# Altium schematic sheet SCH.SchDoc
size A3; SheetNumber: 1; SheetTotal: 1
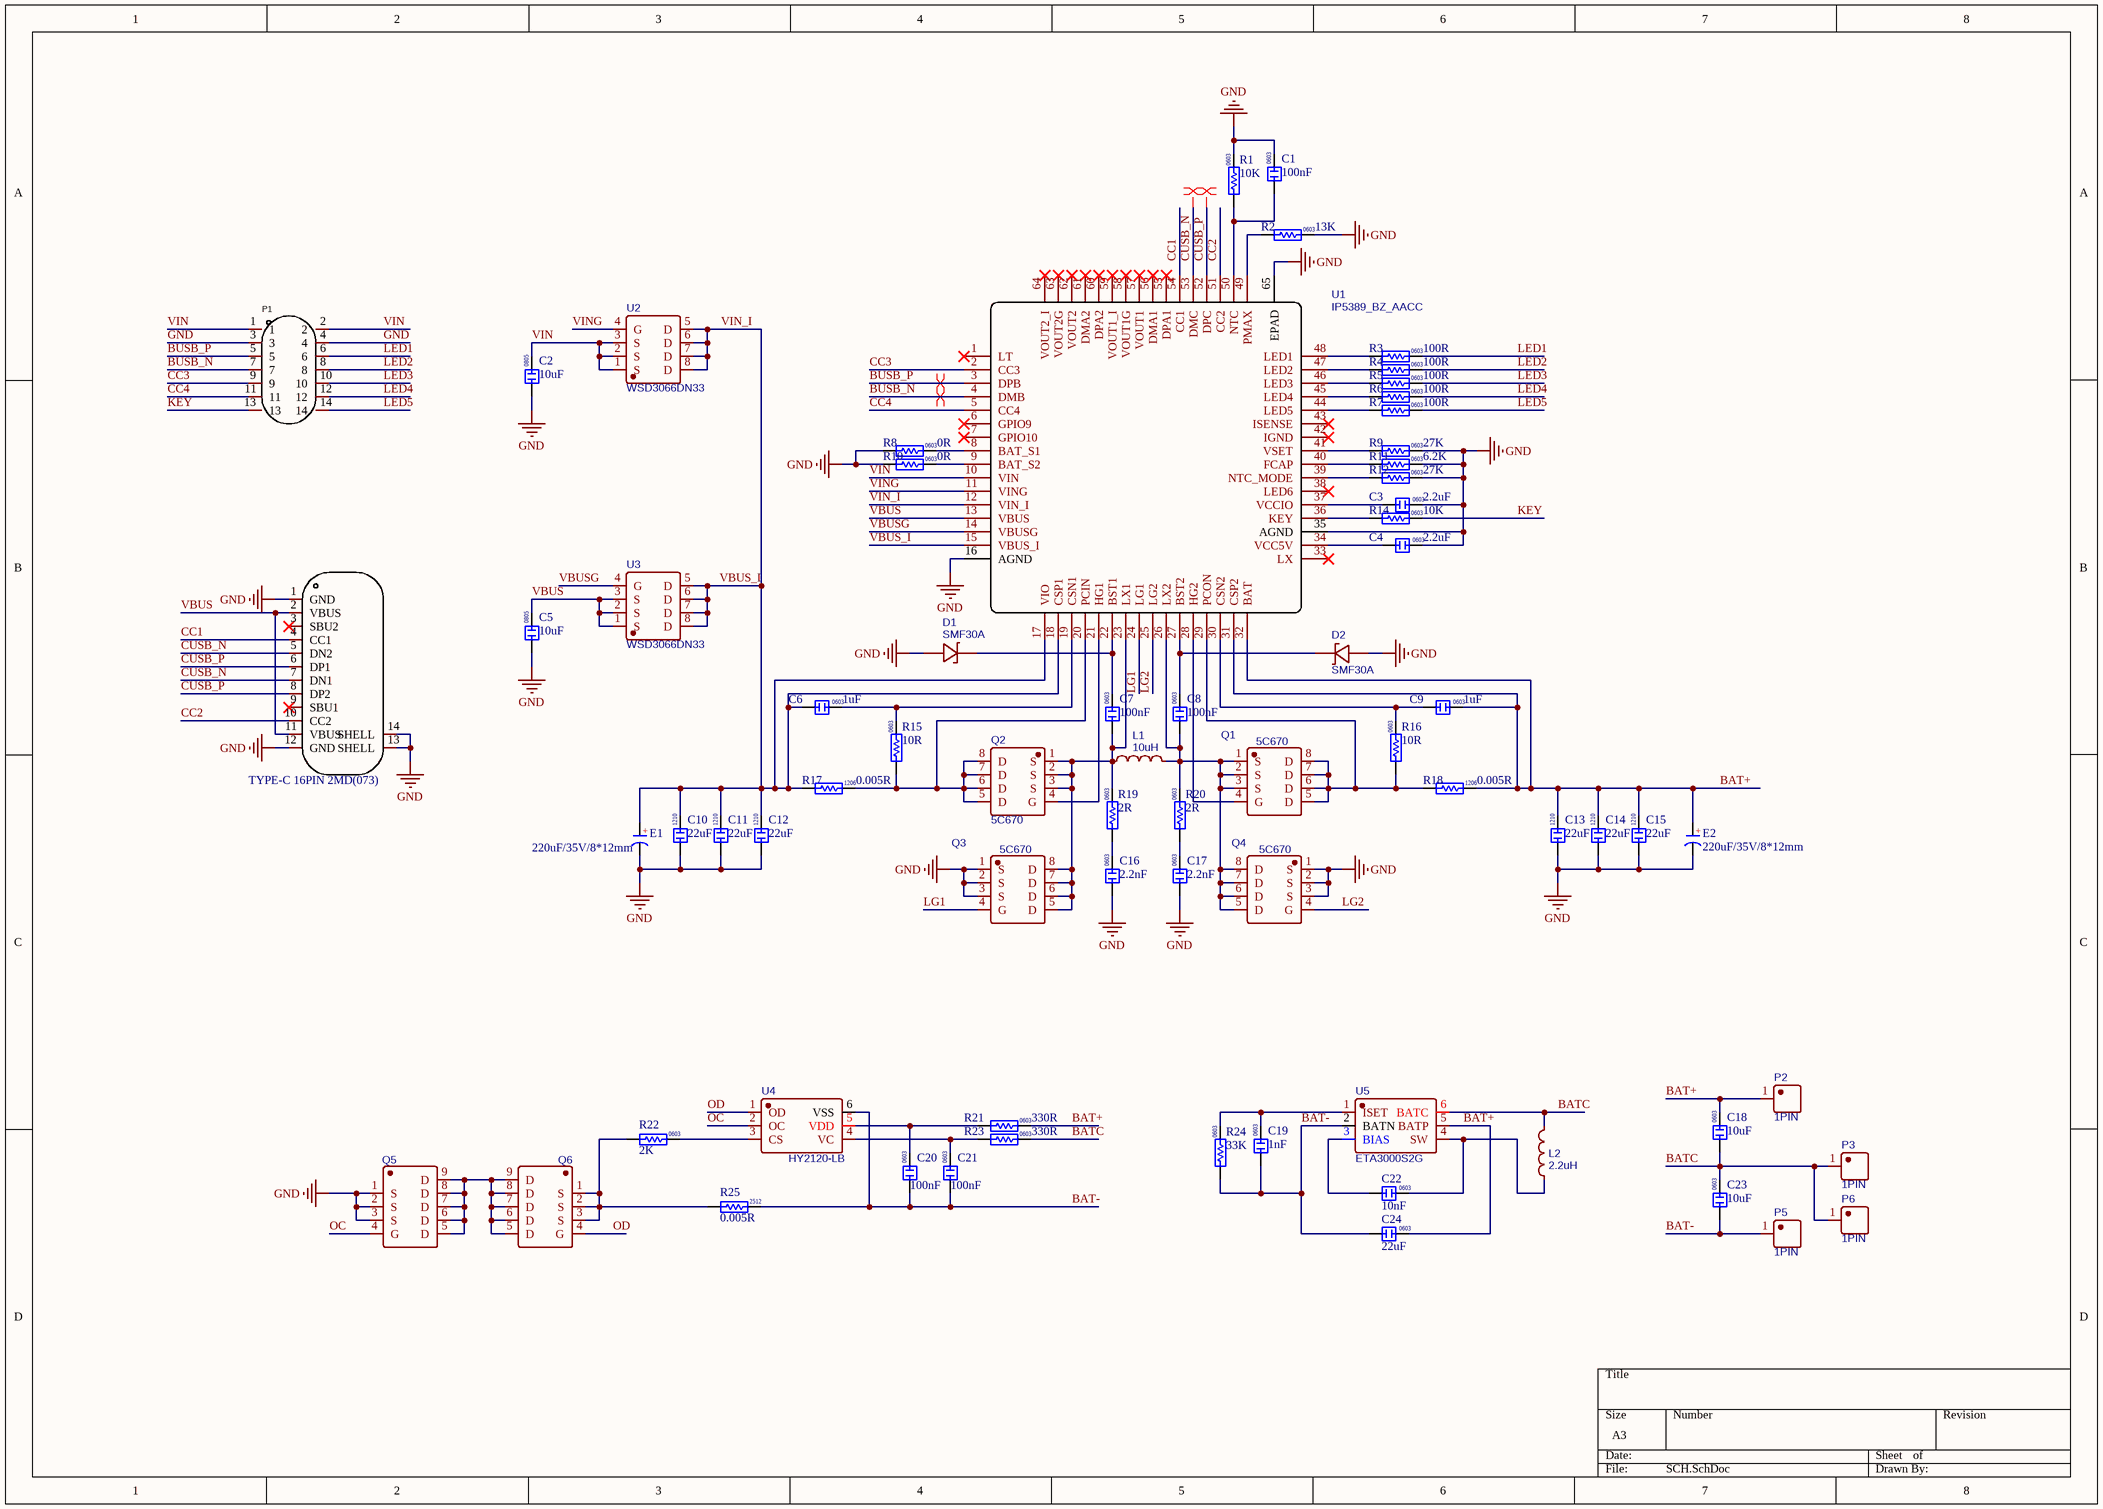
[diagram p0: SCH.SchDoc]

## Parts
C1  100nF  [C_0603]
C2  10uF  [C_0805]
C3  2.2uF  [C_0603]
C4  2.2uF  [C_0603]
C5  10uF  [C_0805]
C6  1uF  [C_0603]
C7  100nF  [C_0603]
C8  100nF  [C_0603]
C9  1uF  [C_0603]
C10  22uF  [C_1210]
C11  22uF  [C_1210]
C12  22uF  [C_1210]
C13  22uF  [C_1210]
C14  22uF  [C_1210]
C15  22uF  [C_1210]
C16  2.2nF  [C_0603]
C17  2.2nF  [C_0603]
C18  10uF  [C_0603]
C19  1nF  [C_0603]
C20  100nF  [C_0603]
C21  100nF  [C_0603]
C22  10nF  [C_0603]
C23  10uF  [C_0603]
C24  22uF  [C_0603]
D1  SMF30A  [SOD-123FL_L2.6-W1.6-LS3.4-R-FD]
D2  SMF30A  [SOD-123FL_L2.6-W1.6-LS3.4-R-FD]
E1  220uF/35V/8*12mm  [CAP 3.5*8*12_L]
E2  220uF/35V/8*12mm  [CAP 3.5*8*12_L]
L1  10uH  [IND-SMD_L11.0-W10.2]
L2  2.2uH  [L_4*4]
P1  X1321WR-2x07J-C40D18  [HDR-TH_14P-P1.27-H-M-R2-C7-S1.27-W7.5-N2]  (value not drawn)
P2  1PIN  [1PIN]
P3  1PIN  [1PIN]
P5  1PIN  [1PIN]
P6  1PIN  [1PIN]
Q1  5C670  [DFN-5_L6.1-W5.1-P1.27-BL]
Q2  5C670  [DFN-5_L6.1-W5.1-P1.27-BL]
Q3  5C670  [DFN-5_L6.1-W5.1-P1.27-BL]
Q4  5C670  [DFN-5_L6.1-W5.1-P1.27-BL]
Q5  TPH1R403NL  [DSOP-8_L5.0-W5.0-P1.27-LS6.0-BL-EP]  (value not drawn)
Q6  TPH1R403NL  [DSOP-8_L5.0-W5.0-P1.27-LS6.0-BL-EP]  (value not drawn)
R1  10K  [R_0603]
R2  13K  [R_0603]
R3  100R  [R_0603]
R4  100R  [R_0603]
R5  100R  [R_0603]
R6  100R  [R_0603]
R7  100R  [R_0603]
R8  0R  [R_0603]
R9  27K  [R_0603]
R10  0R  [R_0603]
R11  6.2K  [R_0603]
R12  27K  [R_0603]
R14  10K  [R_0603]
R15  10R  [R_0603]
R16  10R  [R_0603]
R17  0.005R  [R_1206]
R18  0.005R  [R_1206]
R19  2R  [R_0603]
R20  2R  [R_0603]
R21  330R  [R_0603]
R22  2K  [R_0603]
R23  330R  [R_0603]
R24  33K  [R_0603]
R25  0.005R  [R_2512]
U1  IP5389_BZ_AACC  [QFN-64_IP5389]
U2  WSD3066DN33  [DFN-8_L3.3-W3.3-P0.65-BL]
U3  WSD3066DN33  [DFN-8_L3.3-W3.3-P0.65-BL]
U4  HY2120-LB  [SOT-23-6_L2.9-W1.6-P0.95-LS2.8-BR]
U5  ETA3000S2G  [SOT-23-6_L2.9-W1.6-P0.95-LS2.8-BL]
USB1  TYPE-C 16PIN 2MD(073)  [USB-C-SMD_TYPE-C-6PIN-2MD-073]

## Nets
GND: C1.2 C2.1 C3.2 C4.2 C5.1 C10.1 C11.1 C12.1 C13.1 C14.1 C15.1 C16.1 C17.1 D1.2(A) D2.2(A) E1.2(K) E2.2(K) P1.3 P1.4 Q3.1(S) Q3.2(S) Q3.3(S) Q4.1(S) Q4.2(S) Q4.3(S) Q5.1(S) Q5.2(S) Q5.3(S) R1.2 R2.2 R8.1 R9.2 R10.1 R11.2 R12.2 U1.16(AGND) U1.35(AGND) U1.65(EPAD) USB1.1(GND) USB1.12(GND) USB1.13(SHELL) USB1.14(SHELL)
BAT+: C9.2 C13.2 C14.2 C15.2 C18.2 C24.2 E2.1(A) P2.1 R18.2 R21.2 U1.31(CSP2) U1.32(BAT) U5.5(BATP)
BAT-: C19.1 C20.1 C21.1 C23.1 C24.1 P5.1 R24.1 R25.2 U4.6(VSS) U5.2(BATN)
BATC: C18.1 C23.2 L2.2 P3.1 P6.1 R23.2 U5.6(BATC)
BUSB_N: P1.7 U1.4(DMB)
BUSB_P: P1.5 U1.3(DPB)
CC1: U1.54(CC1) USB1.4(CC1)
CC2: U1.51(CC2) USB1.10(CC2)
CC3: P1.9 U1.2(CC3)
CC4: P1.11 U1.5(CC4)
CUSB_N: U1.53(DMC) USB1.5(DN2) USB1.7(DN1)
CUSB_P: U1.52(DPC) USB1.6(DP1) USB1.8(DP2)
KEY: P1.13 R14.2
LED1: P1.6 R3.2
LED2: P1.8 R4.2
LED3: P1.10 R5.2
LED4: P1.12 R6.2
LED5: P1.14 R7.2
LG1: Q3.4(G) U1.24(LG1)
LG2: Q4.4(G) U1.25(LG2)
OC: Q5.4(G) U4.2(OC)
OD: Q6.4(G) U4.1(OD)
VBUS: C5.2 U1.13(VBUS) U3.1(S) U3.2(S) U3.3(S) USB1.2(VBUS) USB1.11(VBUS)
VBUS_I: C6.1 C10.2 C11.2 C12.2 E1.1(A) R17.1 U1.12(VIN_I) U1.15(VBUS_I) U1.17(VIO) U1.18(CSP1) U2.5(D) U2.6(D) U2.7(D) U2.8(D) U3.5(D) U3.6(D) U3.7(D) U3.8(D)  [also labelled VIN_I]
VBUSG: U1.14(VBUSG) U3.4(G)
VIN: C2.2 P1.1 P1.2 U1.10(VIN) U2.1(S) U2.2(S) U2.3(S)
VING: U1.11(VING) U2.4(G)
NetC1_1: C1.1 R1.1 U1.50(NTC)
NetC3_1: C3.1 U1.37(VCCIO)
NetC4_1: C4.1 U1.34(VCC5V)
NetC6_2: C6.2 R15.2 U1.19(CSN1)
NetC7_1: C7.1 L1.1 Q2.1(S) Q2.2(S) Q2.3(S) Q3.5(D) Q3.6(D) Q3.7(D) Q3.8(D) R19.2 U1.23(LX1)
NetC7_2: C7.2 D1.1(K) U1.22(BST1)
NetC8_1: C8.1 L1.2 Q1.1(S) Q1.2(S) Q1.3(S) Q4.5(D) Q4.6(D) Q4.7(D) Q4.8(D) R20.2 U1.26(LX2)
NetC8_2: C8.2 D2.1(K) U1.27(BST2)
NetC9_1: C9.1 R16.2 U1.30(CSN2)
NetC16_2: C16.2 R19.1
NetC17_2: C17.2 R20.1
NetC19_2: C19.2 R24.2 U5.1(ISET)
NetC20_2: C20.2 R21.1 U4.5(VDD)
NetC21_2: C21.2 R23.1 U4.4(VC)
NetC22_1: C22.1 U5.3(BIAS)
NetC22_2: C22.2 L2.1 U5.4(SW)
NetQ1_4: Q1.4(G) U1.28(HG2)
NetQ1_5: Q1.5(D) Q1.6(D) Q1.7(D) Q1.8(D) R16.1 R18.1 U1.29(PCON)
NetQ2_4: Q2.4(G) U1.21(HG1)
NetQ2_5: Q2.5(D) Q2.6(D) Q2.7(D) Q2.8(D) R15.1 R17.2 U1.20(PCIN)
NetQ5_5: Q5.5(D) Q5.6(D) Q5.7(D) Q5.8(D) Q5.9(D) Q6.5(D) Q6.6(D) Q6.7(D) Q6.8(D) Q6.9(D)
NetQ6_1: Q6.1(S) Q6.2(S) Q6.3(S) R22.1 R25.1
NetR2_1: R2.1 U1.49(PMAX)
NetR3_1: R3.1 U1.48(LED1)
NetR4_1: R4.1 U1.47(LED2)
NetR5_1: R5.1 U1.46(LED3)
NetR6_1: R6.1 U1.45(LED4)
NetR7_1: R7.1 U1.44(LED5)
NetR8_2: R8.2 U1.8(BAT_S1)
NetR9_1: R9.1 U1.41(VSET)
NetR10_2: R10.2 U1.9(BAT_S2)
NetR11_1: R11.1 U1.40(FCAP)
NetR12_1: R12.1 U1.39(NTC_MODE)
NetR14_1: R14.1 U1.36(KEY)
NetR22_2: R22.2 U4.3(CS)

Not connected (* = marked no-connect by the designer): U1 1(LT)* 6(GPIO9)* 7(GPIO10)* 33(LX)* 38(LED6)* 42(IGND)* 43(ISENSE)* 55(DPA1)* 56(DMA1)* 57(VOUT1)* 58(VOUT1G)* 59(VOUT1_I)* 60(DPA2)* 61(DMA2)* 62(VOUT2)* 63(VOUT2G)* 64(VOUT2_I)*; USB1 3(SBU2)* 9(SBU1)*

## Layout directives
differential pair: BUSB_N, BUSB_P, CUSB_N, CUSB_P

## Notes on the sheet
- (in symbol C-CS) +
- (in symbol C_0603) 0603
- (in symbol C_0805) 0805
- (in symbol C_1210) 1210
- (in symbol R_0603) 0603
- (in symbol R_1206) 1206
- (in symbol R_2512) 2512

## Library data of the parts
C1 C3 C4 C6-C9 C16-C24 = C_0603: 贴片电容
C2 C5 = C_0805: 贴片电容
C10-C15 = C_1210: 贴片电容
D1 D2 = SMF30A_C364281: Manufacturer: (MDD) Jiangsu Yutai Elec; Contributor: LCSC; Supplier: LCSC; Supplier Part: C364281; Manufacturer Part: SMF30A; JLCPCB Part Class: Extended Part; spicePre: D; spiceSymbolName: SMF30A_C364281
E1 E2 = C-CS: 直插固态电容; 版权归属: 源创客; BOM名称: 直插固态电容; 学习资源: www.ooocke.com
L1 = 5.6uH: PSPMAA1040H-100M-ANP; Manufacturer: Sunlord; Manufacturer Part: MWSA1206S-5R6MT; nameAlias: Inductance; Contributor: LCSC; Supplier: LCSC; Supplier Part: C408522; JLCPCB Part Class: Extended Part; spicePre: L; spiceSymbolName: MWSA1206S-5R6MT
L2 = 2.2uH: Manufacturer: EMTEK; Manufacturer Part: PHC0420-2R2M-T; nameAlias: Inductance; Contributor: LCSC; Supplier: LCSC; Supplier Part: C251688; JLCPCB Part Class: Extended Part; spicePre: L; spiceSymbolName: PHC0420-2R2M-T
P1 = X1321WR-2x07J-C40D18: 插针; Manufacturer: XKB Connectivity(中国星坤); Add into BOM: yes; Pitch: 1.27mm; Pin Structure: 2x7P; Circluar Pins/Square Pins: 方针; Current Rating (Max): 1A; Voltage Rating (Max): 250V; Welding Temperature (Max): 260℃; Name: X1321WR-2x07J-C40D18; Symbol: X1321WR-2X07J-C40D18; Device: X1321WR-2x07J-C40D18; LCSC Part Name: 1.27mm 2x7P 弯插 方针; Supplier Part: C2881827; Manufacturer Part: X1321WR-2x07J-C40D18; Supplier Footprint: 插件,P=1.27mm; JLCPCB Part Class: Extended Part; Supplier: LCSC; Convert to PCB: yes; Number of Pins: 14; Number of Rows: 2; Row Spacing: 1.27mm; Mounting Type: 弯插; Length of Mating Pin: 4mm; Insulation Height: 1mm; Length of End Connection Pin: -; Contact Material: 黄铜; Contact Plating: 金; Operating Temperature Range: -40℃~+105℃
P2 P3 P5 P6 = 1PIN: 焊点; Manufacturer: ZHENGLING; Manufacturer Part: Z-211-0311-0021-001; Contributor: LCSC; Supplier: LCSC; Supplier Part: C152153; JLCPCB Part Class: Extended Part; spicePre: H; spiceSymbolName: Z-211-0311-0021-001
Q1-Q4 = 5C670: NTMFS5C670NLT1G; Manufacturer: ON Semicon; Contributor: LCSC; Supplier: LCSC; Supplier Part: C179626; Manufacturer Part: NTMFS5C670NLT1G; JLCPCB Part Class: Extended Part; spicePre: Q; spiceSymbolName: BSC059N04LS6
Q5 Q6 = SIRA12DP-T1-GE3: Manufacturer: Vishay Intertech; Contributor: LCSC; Supplier: LCSC; Supplier Part: C241863; Manufacturer Part: SIRA12DP-T1-GE3; JLCPCB Part Class: Extended Part; spicePre: Q; spiceSymbolName: SIRA12DP-T1-GE3
R1-R12 R14-R16 R19-R24 = R_0603: 贴片电阻
R17 R18 = R_1206: 贴片电阻
R25 = R_2512: 贴片电阻
U1 = IP5389_BZ_AACC: 芯片; Contributor: LoveLoli; spicePre: U; spiceSymbolName: IP5389
U2 U3 = WSD3066DN33: NMOS管; Manufacturer Part: NTMFS5C670NLT1G; Manufacturer: ON Semicon; Contributor: LCSC; Supplier: LCSC; Supplier Part: C179626; JLCPCB Part Class: Extended Part; spicePre: Q; spiceSymbolName: BSC059N04LS6
U4 = HY2120-LB: Manufacturer: HYCON; Contributor: LCSC; Supplier: LCSC; Manufacturer Part: HY2120-LB; Supplier Part: C168778; JLCPCB Part Class: Extended Part; spicePre: U; spiceSymbolName: HY2120-LB
U5 = ETA3000S2G: 芯片; Manufacturer: ETA(钰泰); Contributor: ryq1212; SMT Type: Extend; Manufacturer Part: ETA3000S2G; LCSC Assembly: Yes; spicePre: U; spiceSymbolName: ETA3000S2G
USB1 = TYPE-C 16PIN 2MD(073): USB C母座; Manufacturer: SHOU HAN(首韩); Add into BOM: yes; Gender: 母座; Number of Contacts: 16; Number of Ports: 1; Current Rating - Power (Max): 5A; Name: TYPE-C 16PIN 2MD(073); Symbol: TYPE-C 16PIN 2MD(073); Device: TYPE-C 16PIN 2MD(073); LCSC Part Name: TYPE-C母座 16P 4脚插件带定位柱 不锈钢外壳 2次模顶; Supplier Part: C2765186; Manufacturer Part: TYPE-C 16PIN 2MD(073); Supplier Footprint: SMD; JLCPCB Part Class: Extended Part; Supplier: LCSC; Convert to PCB: yes; Connector Type: Type-C; Standard: -; Mounting Style: 卧贴; Operating Temperature Range: -25℃~+85℃